# EAGLE design Adafruit LoRa Radio Bonnet with OLED (EAGLE 9.2.0)
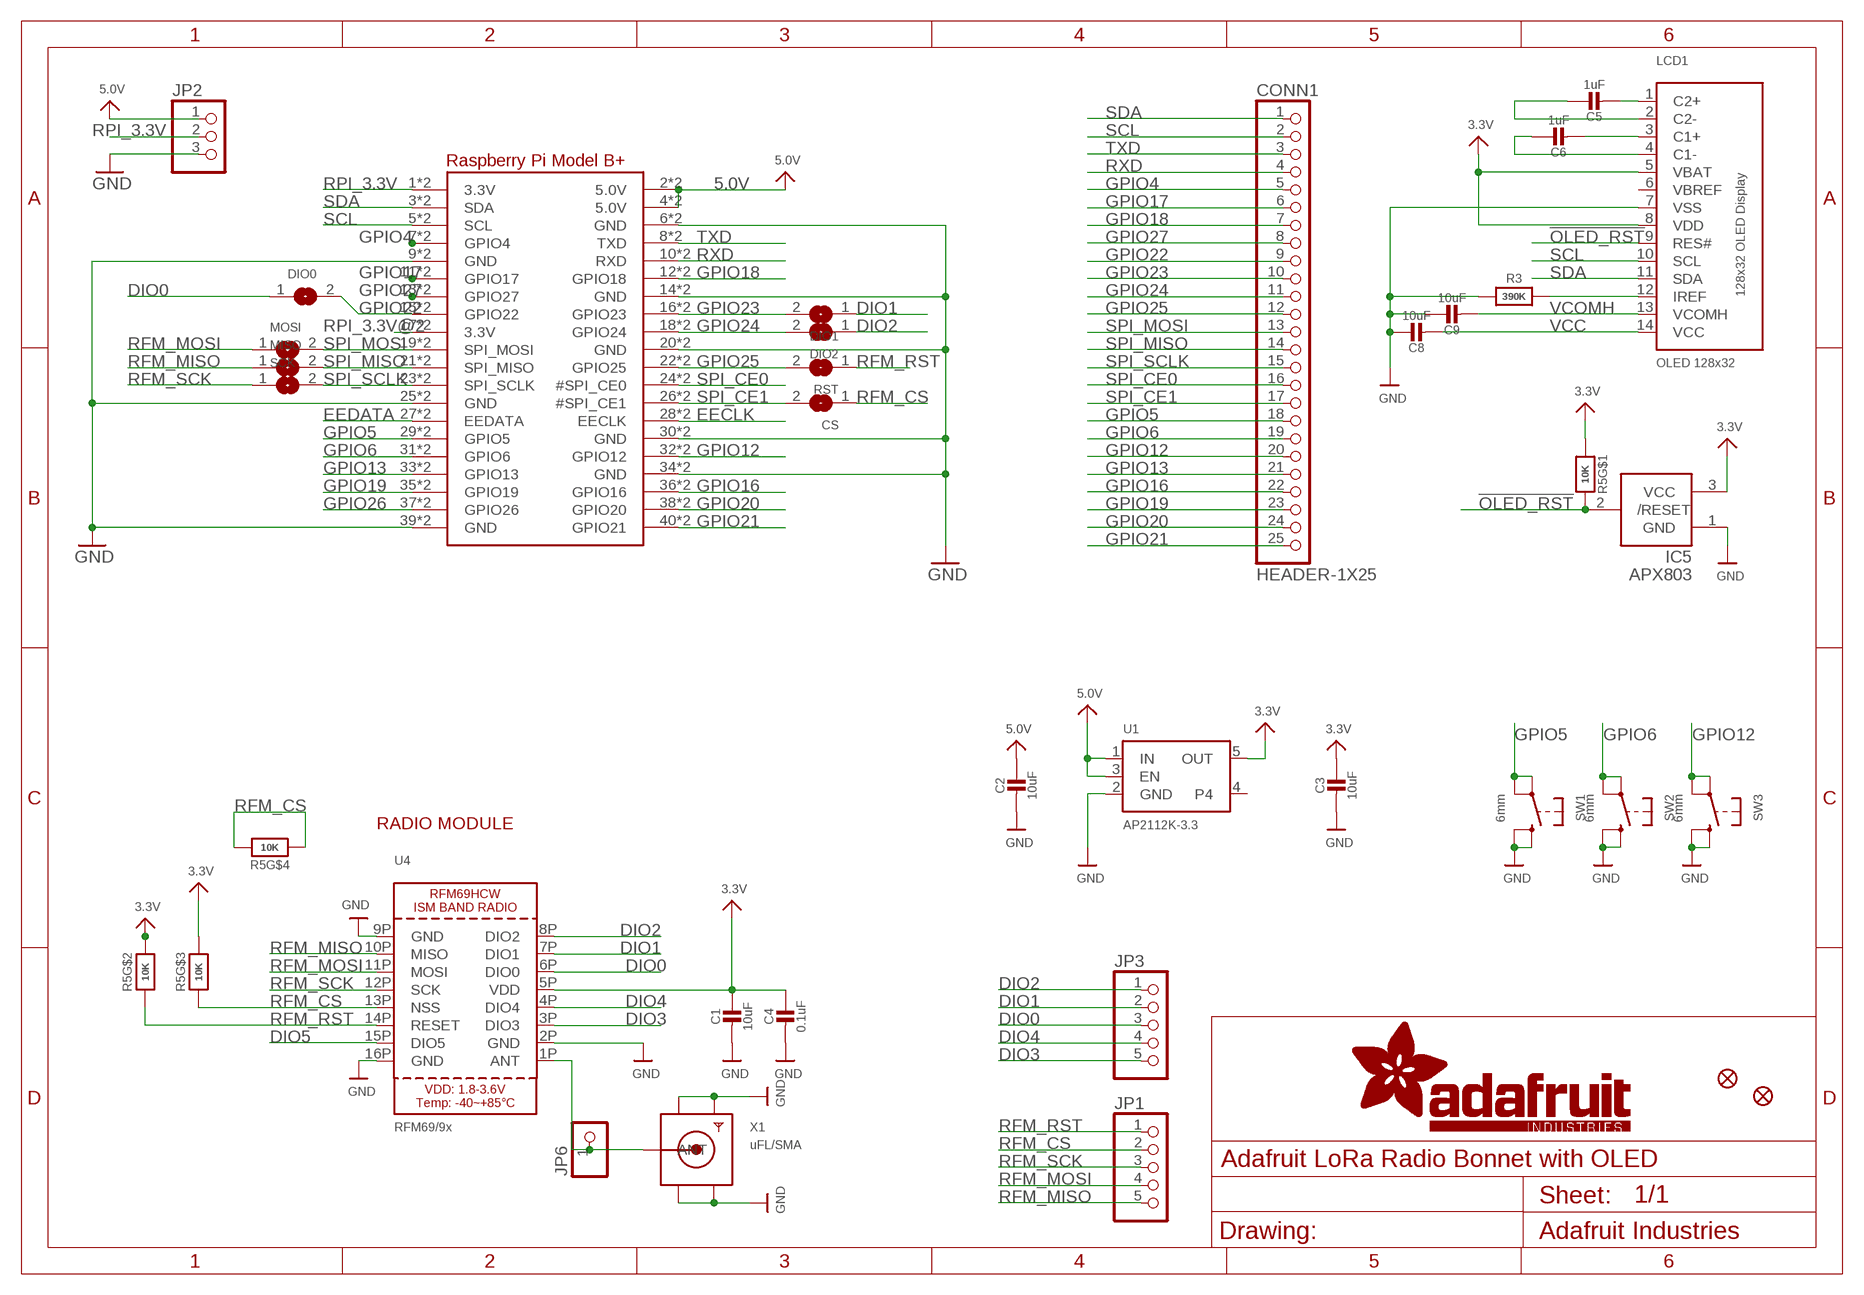
[diagram p0: schematic, sheet 1]

## Parts
C1  10uF  CAP_CERAMIC0805-NOOUTLINE  [0805-NO]
C2  10uF  CAP_CERAMIC0805-NOOUTLINE  [0805-NO]
C3  10uF  CAP_CERAMIC0805-NOOUTLINE  [0805-NO]
C4  0.1uF  CAP_CERAMIC0603_NO  [0603-NO]
C5  1uF  CAP_CERAMIC0603_NO  [0603-NO]
C6  1uF  CAP_CERAMIC0603_NO  [0603-NO]
C8  10uF  CAP_CERAMIC0805-NOOUTLINE  [0805-NO]
C9  10uF  CAP_CERAMIC0805-NOOUTLINE  [0805-NO]
CONN1  HEADER-1X25  [1X25_ROUND_70MIL]
CS  SOLDERJUMPERCLOSED  [SOLDERJUMPER_CLOSEDWIRE]
DIO0  SOLDERJUMPERCLOSED  [SOLDERJUMPER_CLOSEDWIRE]
DIO1  SOLDERJUMPERCLOSED  [SOLDERJUMPER_CLOSEDWIRE]
DIO2  SOLDERJUMPERCLOSED  [SOLDERJUMPER_CLOSEDWIRE]
FID1  FIDUCIAL_1MM  [FIDUCIAL_1MM]
FID2  FIDUCIAL_1MM  [FIDUCIAL_1MM]
IC5  APX803  AXP083-SAG  [SOT23]
JP1  HEADER-1X570MIL  [1X05_ROUND_70]
JP2  HEADER-1X3ROUND  [1X03_ROUND]
JP3  HEADER-1X570MIL  [1X05_ROUND_70]
JP6  HEADER-1X1ROUND  [1X01_ROUND]
LCD1  OLED 128x32  DISP_OLED_UG-2832HSWEG02  [UG-2832HSWEG02_WRAPUNDER]
MISO  SOLDERJUMPERCLOSED  [SOLDERJUMPER_CLOSEDWIRE]
MOSI  SOLDERJUMPERCLOSED  [SOLDERJUMPER_CLOSEDWIRE]
R3  390K  RESISTOR_0603_NOOUT  [0603-NO]
R5  10K  RESISTOR_4PACK  [RESPACK_4X0603]
RPI1  RASPBERRYPI_BPLUS_BONNET_THMSMT  [PI_BONNET_THMSMT]
RST  SOLDERJUMPERCLOSED  [SOLDERJUMPER_CLOSEDWIRE]
SCK  SOLDERJUMPERCLOSED  [SOLDERJUMPER_CLOSEDWIRE]
SW1  6mm  SWITCH_TACT_SMT_EVQQ2_SMALL  [EVQ-Q2_SMALLER]
SW2  6mm  SWITCH_TACT_SMT_EVQQ2_SMALL  [EVQ-Q2_SMALLER]
SW3  6mm  SWITCH_TACT_SMT_EVQQ2_SMALL  [EVQ-Q2_SMALLER]
U1  AP2112K-3.3  VREG_SOT23-5  [SOT23-5]
U4  RFM69/9x  RFM69HCW_SMT  [RFMHCW_SMT]
X1  uFL/SMA  SMACONNECTOR_EDGE_UFL  [SMA_EDGELAUNCH_UFL]

## Nets
3.3V: C1.1 C3.1 C4.1 IC5.3(VCC) LCD1.5(VBAT) LCD1.8(VDD) R5.1 R5.6 R5.7 U1.5(OUT) U4.5P(VDD)
5.0V: C2.1 JP2.1 RPI1.2(5.0V) RPI1.4(5.0V) RPI1.S2(5.0V) RPI1.S4(5.0V) U1.1(IN) U1.3(EN)
!OLED_RST: IC5.2(/RESET) LCD1.9(RES#) R5.8
ANT: JP6.1 U4.1P(ANT) X1.P(ANT)
DIO0: DIO0.1 JP3.3 U4.6P(DIO0)
DIO1: DIO1.1 JP3.2 U4.7P(DIO1)
DIO2: DIO2.1 JP3.1 U4.8P(DIO2)
DIO3: JP3.5 U4.3P(DIO3)
DIO4: JP3.4 U4.4P(DIO4)
DIO5: U4.15P(DIO5)
EECLK: RPI1.28(EECLK) RPI1.S28(EECLK)
EEDATA: RPI1.27(EEDATA) RPI1.S27(EEDATA)
GND: C1.2 C2.2 C3.2 C4.2 C8.1 C9.1 IC5.1(GND) JP2.3 LCD1.7(VSS) R3.1 RPI1.6(GND) RPI1.9(GND) RPI1.14(GND) RPI1.20(GND) RPI1.25(GND) RPI1.30(GND) RPI1.34(GND) RPI1.39(GND) RPI1.S6(GND) RPI1.S9(GND) RPI1.S14(GND) RPI1.S20(GND) RPI1.S25(GND) RPI1.S30(GND) RPI1.S34(GND) RPI1.S39(GND) SW1.B'(S1) SW1.B(S) SW2.B'(S1) SW2.B(S) SW3.B'(S1) SW3.B(S) U1.2(GND) U4.2P(GND) U4.9P(GND) U4.16P(GND) X1.GND@1(GND1) X1.GND@2(GND2) X1.GND@3(GND3) X1.GND@4(GND4)
GPIO4: CONN1.5 RPI1.7(GPIO4) RPI1.S7(GPIO4)
GPIO5: CONN1.18 RPI1.29(GPIO5) RPI1.S29(GPIO5) SW1.A'(P1) SW1.A(P)
GPIO6: CONN1.19 RPI1.31(GPIO6) RPI1.S31(GPIO6) SW2.A'(P1) SW2.A(P)
GPIO12: CONN1.20 RPI1.32(GPIO12) RPI1.S32(GPIO12) SW3.A'(P1) SW3.A(P)
GPIO13: CONN1.21 RPI1.33(GPIO13) RPI1.S33(GPIO13)
GPIO16: CONN1.22 RPI1.36(GPIO16) RPI1.S36(GPIO16)
GPIO17: CONN1.6 RPI1.11(GPIO17) RPI1.S11(GPIO17)
GPIO18: CONN1.7 RPI1.12(GPIO18) RPI1.S12(GPIO18)
GPIO19: CONN1.23 RPI1.35(GPIO19) RPI1.S35(GPIO19)
GPIO20: CONN1.24 RPI1.38(GPIO20) RPI1.S38(GPIO20)
GPIO21: CONN1.25 RPI1.40(GPIO21) RPI1.S40(GPIO21)
GPIO22: CONN1.9 DIO0.2 RPI1.15(GPIO22) RPI1.S15(GPIO22)
GPIO23: CONN1.10 DIO1.2 RPI1.16(GPIO23) RPI1.S16(GPIO23)
GPIO24: CONN1.11 DIO2.2 RPI1.18(GPIO24) RPI1.S18(GPIO24)
GPIO25: CONN1.12 RPI1.22(GPIO25) RPI1.S22(GPIO25) RST.2
GPIO26: RPI1.37(GPIO26) RPI1.S37(GPIO26)
GPIO27: CONN1.8 RPI1.13(GPIO27) RPI1.S13(GPIO27)
N$1: C5.2 LCD1.1(C2+)
N$2: C5.1 LCD1.2(C2-)
N$3: C6.2 LCD1.3(C1+)
N$4: C6.1 LCD1.4(C1-)
N$7: LCD1.12(IREF) R3.2
RFM_CS: CS.1 JP1.2 R5.3 R5.4 R5.5 U4.13P(NSS)
RFM_MISO: JP1.5 MISO.1 U4.10P(MISO)
RFM_MOSI: JP1.4 MOSI.1 U4.11P(MOSI)
RFM_RST: JP1.1 R5.2 RST.1 U4.14P(RESET)
RFM_SCK: JP1.3 SCK.1 U4.12P(SCK)
RPI_3.3V: JP2.2 RPI1.1(3.3V) RPI1.S1(3.3V)
RPI_3.3V@2: RPI1.17(3.3V) RPI1.S17(3.3V)
RXD: CONN1.4 RPI1.10(RXD) RPI1.S10(RXD)
SCL: CONN1.2 LCD1.10(SCL) RPI1.5(SCL) RPI1.S5(SCL)
SDA: CONN1.1 LCD1.11(SDA) RPI1.3(SDA) RPI1.S3(SDA)
SPI_CE0: CONN1.16 RPI1.24(#SPI_CE0) RPI1.S24(#SPI_CE0)
SPI_CE1: CONN1.17 CS.2 RPI1.26(#SPI_CE1) RPI1.S26(#SPI_CE1)
SPI_MISO: CONN1.14 MISO.2 RPI1.21(SPI_MISO) RPI1.S21(SPI_MISO)
SPI_MOSI: CONN1.13 MOSI.2 RPI1.19(SPI_MOSI) RPI1.S19(SPI_MOSI)
SPI_SCLK: CONN1.15 RPI1.23(SPI_SCLK) RPI1.S23(SPI_SCLK) SCK.2
TXD: CONN1.3 RPI1.8(TXD) RPI1.S8(TXD)
VCC: C8.2 LCD1.14(VCC)
VCOMH: C9.2 LCD1.13(VCOMH)
Unconnected: U1.4

## Notes on the sheet
- RADIO MODULE

## Power pins joined to a net without a drawn wire
VBREF: LCD1.6(VBREF)

## Library data of the parts
C1-C6 C8 C9 = microbuilder:CAP_CERAMIC: Ceramic Capacitors For new designs, use the packages preceded by an '_' character since they are more reliable: The following footprints should be used on most boards: _0402 - Standard footprint for regular board layouts _0603 - Standard footprint for regular board layouts _0805 - Standard footprint for regular board layouts _1206 - Standard footprint for regular board layouts For extremely tight-pitch boards where space is at a premium, the following 'micro-pitch' footprints can be used (smaller pads, no silkscreen outline, etc.): _0402MP - Micro-pitch footprint for very dense/compact boards _0603MP - Micro-pitch footprint for very dense/compact boards _0805MP - Micro-pitch footprint for very dense/compact boards _1206MP - Micro-pitch footprint for very dense/compact boards
CONN1 = microbuilder:HEADER-1X25
CS DIO0 DIO1 DIO2 MISO MOSI RST SCK = microbuilder:SOLDERJUMPER: SMD Solder JUMPER Solder the two pads together to create a connection, or remove the solder to break it. REFLOW - Use this footprint for solder paste and reflow ovens. WAVE - Use this footprint for hand-soldering (larger pads). CLOSED - Has a trace between the two pads to ensure it is closed by default. The trace needs to be cut to disable the jumper, and can be closed again by creating a solder bridge between the two pads.
FID1 FID2 = microbuilder:FIDUCIAL: Fiducial Alignment Points Various fiducial points for machine vision alignment.; BOM: EXCLUDE
IC5 = adafruit:AXP083
JP1 JP3 = microbuilder:HEADER-1X5: PIN HEADER
JP2 = microbuilder:HEADER-1X3: PIN HEADER
JP6 = microbuilder:HEADER-1X1: PIN HEADER
LCD1 = microbuilder:DISP_OLED_UG-2832HSWEG02: 128x32 I2C 0.91" Monochrome OLED Display
R3 = microbuilder:RESISTOR: Resistors For new designs, use the packages preceded by an '_' character since they are more reliable: The following footprints should be used on most boards: _0402 - Standard footprint for regular board layouts _0603 - Standard footprint for regular board layouts _0805 - Standard footprint for regular board layouts _1206 - Standard footprint for regular board layouts For extremely tight-pitch boards where space is at a premium, the following 'micro-pitch' footprints can be used (smaller pads, no silkscreen outline, etc.): _0402MP - Micro-pitch footprint for very dense/compact boards _0603MP - Micro-pitch footprint for very dense/compact boards _0805MP - Micro-pitch footprint for very dense/compact boards _1206MP - Micro-pitch footprint for very dense/compact boards
R5 = microbuilder:RESISTOR_4PACK: Resistor Packs (4 resistors) 4 x 0603 10K 1/16W - Digikey: YC164J-10KCT-ND
RPI1 = microbuilder:RASPBERRYPI_BPLUS
SW1-SW3 = microbuilder:SWITCH_TACT_SMT: SMT Tact Switches 6x6mm - Digikey: P12940SCT-ND KMR2 (4.6x2.8mm) - Digikey: 401-1426-1-ND EVQ-PQHB55 - Light Touch, 160GF (4.5x4.5mm) - Digikey: P8090SCT-ND KMT0 - KMT021 NGJ LHS (etc.) IP68/Waterproof - Digikey: CKN10289CT-ND
U1 = microbuilder:VREG_SOT23-5: SOT23-5 Fixed Voltage Regulators Part Current Out V Out V In V Dropout θJA (°C/W) TJ (°C) Digikey Part No. ADP121 150mA 3.3V 3.4-5.5V 0.09V @ 150mA -- -- ADP121-AUJZ33R7CT-ND ADP121 150mA 3.0V 3.1-5.5V 0.09V @ 150mA -- -- ADP121-AUJZ30R7CT-ND ADP122 300mA 3.3V 3.4-5.5V 0.085V @ 300mA -- -- ADP122AUJZ-3.3-R7CT-ND ADP1712 300mA 3.3V 3.5-5.5V 0.17V @ 300mA -- -- ADP1712AUJZ-3.3-R7TR-ND AP7311 (Low Cost) 150mA 3.3V 3.5-6V 0.15V @ 150mA -- -- AP7311-33WG-7DICT-ND LD39015M18R 150mA 1.8V 1.9V-5.5V 0.08V @ 100mA -- -- 497-6977-1-ND LP2985A-33DBVR 150mA 3.3V 3.3-16V 0.28V @ 150mA 206 150 296-18479-1-ND MCP1824T-3302E/OT 300mA 3.3V 3.5V-6V 0.2V @ 300mA -- -- MCP1824T-3302E/OTCT-ND MIC5205-2.5YM5 TR 150mA 2.5V 2.7-16V 0.165V @ 150mA -- -- 576-1257-2-ND MIC5205-3.0YM5 TR 150mA 3.0V 3.2V-16V 0.165V @ 150mA -- -- 576-1258-2-ND MIC5205-3.3YM5 TR 150mA 3.3V 3.5V-16V 0.165V @ 150mA -- -- 576-1259-2-ND TPS780330220 150mA 3.3V+2.2V 3.6-5.5V 250mV Max -- -- 296-23332-1-ND TDA3663/N1,135 100mA 3.3V 3.5-45V 0.18V @ 50mA -- -- 568-5343-1-ND Max operating temp can be calculated using θJA, TJ (max junction temperature), and power in watts. Set the "Maximum Ambient Temperature" until it reaches TJ ("Max Junction Temperature"), which is the absolute limit for safe use of the regulator: Heat Sink Temperature Calculator <http://www.daycounter.com/Calculators/Heat-Sink-Temperature-Calculator.phtml> For example, With 12V source into a 3.3V LP2985 and a 30mA load, we are dissipating (12V-3.3V) * 0.03A = 0.261W. With a θJA of 206 °C/W, a TJ of 150°C, and 261mW we can safely use the chip without a heat sink up to 75°C (=147.1°C Junction Temperature).
U4 = microbuilder:RFM69HCW: RFM69HCW - ISM Band RF Transceiver
X1 = microbuilder:SMACONNECTOR: SMA Connector 90° DIP SMA Connector, 50 Ohm (4UConnector: 07259)

## Board
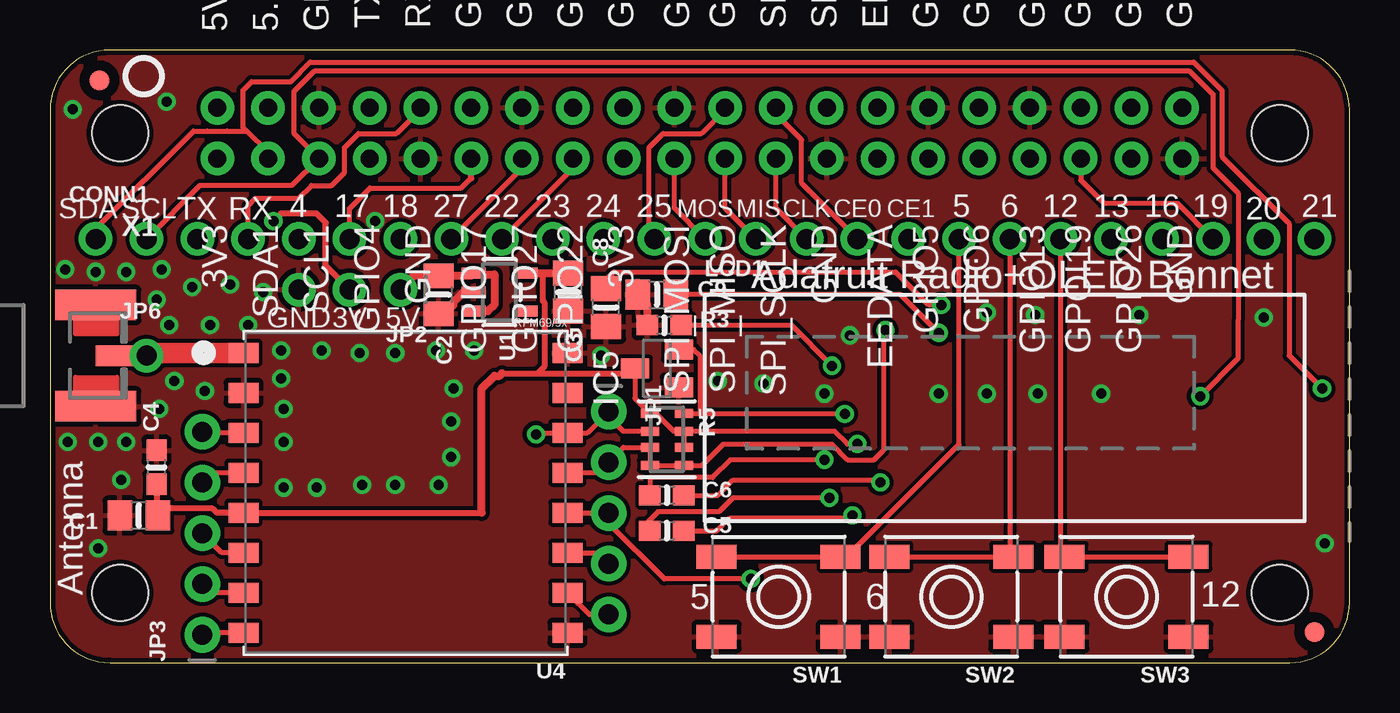
[diagram p1: board, top side]
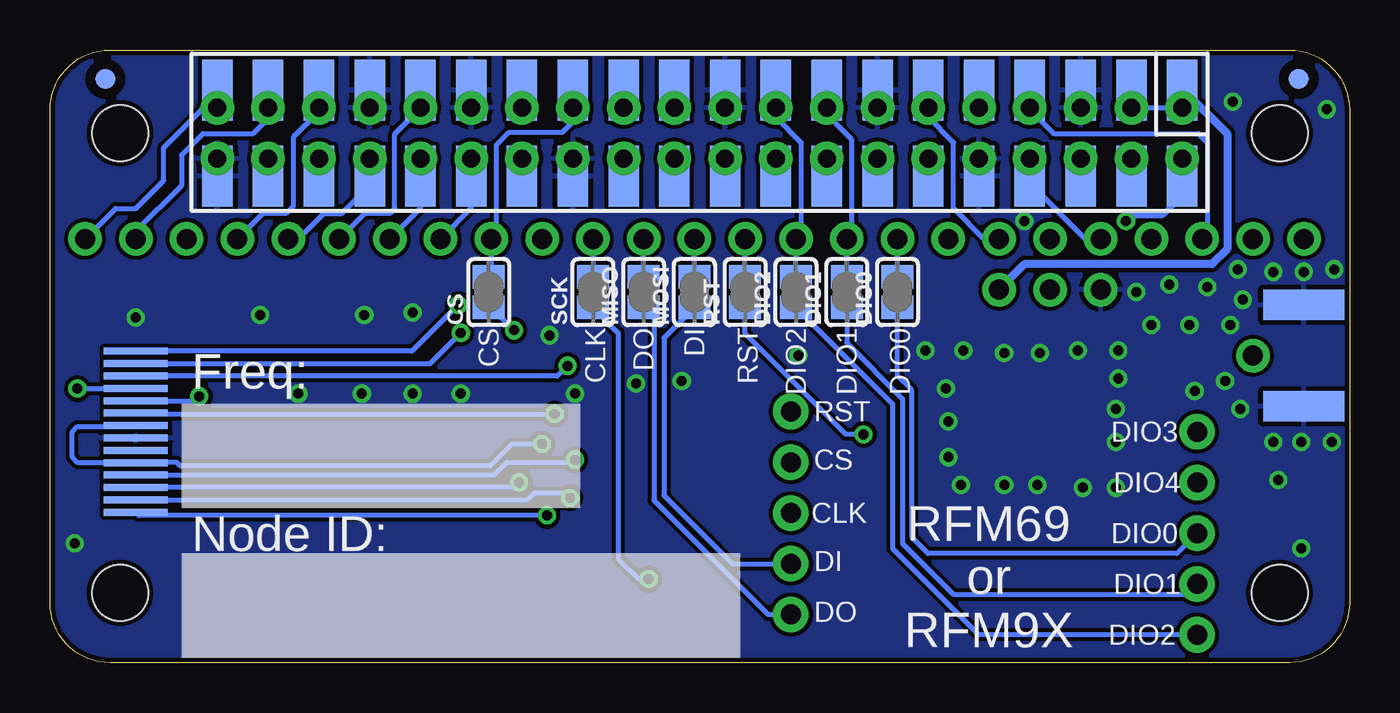
[diagram p2: board, bottom side, seen from below]

Size 65 x 30.66 mm. Coordinates in mm from the lower left corner, seen from the top.
Copper layers (1*16): Top 0.035mm / dielectric 1.5mm / Bottom 0.035mm
Design rules "adafruit *": minimum track width 8mil, minimum drill 15.5mil, track to track 8mil, track to pad 8mil, pad to pad 8mil, via to via 8mil, smd to smd 8mil, copper to edge 10mil, drill to drill 8mil, minimum pad ring 10mil, minimum via ring 8mil, stop-mask expansion 2mil, vias tented up to drill 20mil, thermal gap 10mil

### Footprints (pad centres in the part's own frame; a part is rotated, then mirrored left to right if it is on the bottom)
0805-NO = smd 1.24 x 1.5: 1 -0.95,0; 2 0.95,0
0603-NO = smd 1.075 x 1: 1 -0.85,0; 2 0.85,0
1X25_ROUND_70MIL = drill 1 pad 1.676: 1 -30.48,0; 2 -27.94,0; 3 -25.4,0; 4 -22.86,0; 5 -20.32,0; 6 -17.78,0; 7 -15.24,0; 8 -12.7,0; 9 -10.16,0; 10 -7.62,0; 11 -5.08,0; 12 -2.54,0; 13 0,0; 14 2.54,0; 15 5.08,0; 16 7.62,0; 17 10.16,0; 18 12.7,0; 19 15.24,0; 20 17.78,0; 21 20.32,0; 22 22.86,0; 23 25.4,0; 24 27.94,0; 25 30.48,0
SOLDERJUMPER_CLOSEDWIRE = smd 1.168 x 1.6: 1 -0.762,0; 2 0.762,0 | smd 0.635 x 0.203: WIRE 0,0
FIDUCIAL_1MM = smd 1 x 1: 1 0,0
SOT23 = smd 1 x 1.4: 1 -0.95,-1.1; 2 0.95,-1.1; 3 0,1.1
1X05_ROUND_70 = drill 1 pad 1.778: 1 -5.08,0; 2 -2.54,0; 3 0,0; 4 2.54,0; 5 5.08,0
1X03_ROUND = drill 1 pad 1.676: 1 -2.54,0; 2 0,0; 3 2.54,0
1X01_ROUND = drill 1 pad 1.676: 1 0,0
UG-2832HSWEG02_WRAPUNDER = smd 3.2 x 0.35 bottom: 1 -2.03,-5.3; 2 -2.03,-4.68; 3 -2.03,-4.06; 4 -2.03,-3.44; 5 -2.03,-2.82; 6 -2.03,-2.2; 7 -2.03,-1.58; 8 -2.03,-0.96; 9 -2.03,-0.34; 10 -2.03,0.28; 11 -2.03,0.9; 12 -2.03,1.52; 13 -2.03,2.14; 14 -2.03,2.76
RESPACK_4X0603 = smd 0.45 x 0.9: 1 -1.3,-0.85; 2 -0.4,-0.85; 3 0.4,-0.85; 4 1.3,-0.85; 5 1.3,0.85; 6 0.4,0.85; 7 -0.4,0.85; 8 -1.3,0.85
PI_BONNET_THMSMT = drill 0.9 pad 1.676: 1 8.37,25.23; 2 8.37,27.77; 3 10.91,25.23; 4 10.91,27.77; 5 13.45,25.23; 6 13.45,27.77; 7 15.99,25.23; 8 15.99,27.77; 9 18.53,25.23; 10 18.53,27.77; 11 21.07,25.23; 12 21.07,27.77; 13 23.61,25.23; 14 23.61,27.77; 15 26.15,25.23; 16 26.15,27.77; 17 28.69,25.23; 18 28.69,27.77; 19 31.23,25.23; 20 31.23,27.77; 21 33.77,25.23; 22 33.77,27.77; 23 36.31,25.23; 24 36.31,27.77; 25 38.85,25.23; 26 38.85,27.77; 27 41.39,25.23; 28 41.39,27.77; 29 43.93,25.23; 30 43.93,27.77; 31 46.47,25.23; 32 46.47,27.77; 33 49.01,25.23; 34 49.01,27.77; 35 51.55,25.23; 36 51.55,27.77; 37 54.09,25.23; 38 54.09,27.77; 39 56.63,25.23; 40 56.63,27.77 | smd 1 x 1 bottom: 41 2.54,29.21; 42 62.23,29.21 | smd 1.524 x 3.048 bottom: S1 8.37,24.339; S2 8.37,28.657; S3 10.91,24.339; S4 10.91,28.657; S5 13.45,24.339; S6 13.45,28.657; S7 15.99,24.339; S8 15.99,28.657; S9 18.53,24.339; S10 18.53,28.657; S11 21.07,24.339; S12 21.07,28.657; S13 23.61,24.339; S14 23.61,28.657; S15 26.15,24.339; S16 26.15,28.657; S17 28.69,24.339; S18 28.69,28.657; S19 31.23,24.339; S20 31.23,28.657; S21 33.77,24.339; S22 33.77,28.657; S23 36.31,24.339; S24 36.31,28.657; S25 38.85,24.339; S26 38.85,28.657; S27 41.39,24.339; S28 41.39,28.657; S29 43.93,24.339; S30 43.93,28.657; S31 46.47,24.339; S32 46.47,28.657; S33 49.01,24.339; S34 49.01,28.657; S35 51.55,24.339; S36 51.55,28.657; S37 54.09,24.339; S38 54.09,28.657; S39 56.63,24.339; S40 56.63,28.657 | hole 2.8: 3.5,26.5; 61.5,26.5; 61.5,3.5; 3.5,3.5
EVQ-Q2_SMALLER = smd 2 x 1.2: A -3.1,-2; A' 3.1,-2; B -3.1,2; B' 3.1,2
SOT23-5 = smd 0.55 x 1.2: 1 -0.95,-1.3; 2 0,-1.3; 3 0.95,-1.3; 4 0.95,1.3; 5 -0.95,1.3
RFMHCW_SMT = smd 1.5 x 1: 1P 8.1,-7; 2P 8.1,-5; 3P 8.1,-3; 4P 8.1,-1; 5P 8.1,1; 6P 8.1,3; 7P 8.1,5; 8P 8.1,7; 9P -8.1,7; 10P -8.1,5; 11P -8.1,3; 12P -8.1,1; 13P -8.1,-1; 14P -8.1,-3; 15P -8.1,-5; 16P -8.1,-7
SMA_EDGELAUNCH_UFL = smd 4.064 x 1.524: GND@1 2.032,-2.54; GND@2 2.032,2.54 | smd 4.064 x 1.524 bottom: GND@3 2.032,2.54; GND@4 2.032,-2.54 | smd 2.032 x 1.016: P 3.048,0

### Placement (x,y rotation side)
C1  4.45,7.37 180 top
C2  19.43,18.41 270 top
C3  25.91,18.54 270 top
C4  5.33,9.78 90 top
C5  30.86,6.6 0 top
C6  30.86,8.38 0 top
C8  27.81,17.78 90 top
C9  30.35,18.41 0 top
CONN1  32.77,21.21 0 top
CS  43.05,18.54 90 bottom
DIO0  22.61,18.54 90 bottom
DIO1  25.15,18.54 90 bottom
DIO2  27.69,18.54 90 bottom
FID1  2.48,29.15 0 top
FID2  63.25,1.52 0 top
IC5  30.35,14.73 90 top
JP1  27.94,7.49 270 top
JP2  14.99,18.67 180 top
JP3  7.62,6.48 90 top
JP6  4.83,15.37 0 top
LCD1  62.74,12.83 0 top
MISO  35.31,18.54 90 bottom
MOSI  32.77,18.54 90 bottom
R3  30.73,16.89 0 top
R5  30.86,11.18 270 top
RPI1  0,0 0 top
RST  30.23,18.54 90 bottom
SCK  37.85,18.54 90 bottom
SW1  36.45,3.3 180 top
SW2  45.09,3.3 180 top
SW3  53.85,3.3 180 top
U1  22.48,18.54 270 top
U4  17.78,8.51 180 top
U$22  [PCBFEAT-REV-040]  4.7,29.34 0 top
X1  0.25,15.37 0 top

### Tracks (layer width: path | path; a pad name or v marks a point on that pad's centre or on a via)
3.3V  (via drill 0.5)
  Top 0.254: R5.7 R5.6 | v40.39,10.94 39.88,10.94 39.24,11.58 R5.7 | IC5.3 29.25,13.23 R5.1 30.32,12.48 31.22,11.58 R5.7
  Top 0.305: C4.1 5.33,7.43 C1.1 5.75,7.72 8.14,7.72 8.35,7.51 U4.5P 21.59,7.51 | 22.61,14.48 24.38,14.48 | 24.38,14.48 29,14.48 IC5.3 | 24.64,19.49 24.64,18.11 24.73,18.01 24.73,14.83 24.38,14.48
  Top 0.406: U1.5 24.64,19.49 C3.1 | 21.59,7.51 21.59,13.72 22.23,14.35 22.48,14.35 22.61,14.48
  Bottom 0.254: v40.39,10.94 41.9,10.94 43,9.84 58.48,9.84 58.67,10.03 60.68,10.03 LCD1.5 63.6,10.01 63.88,10.29 63.88,11.56 63.63,11.81 60.76,11.81 LCD1.8
5.0V
  Top 0.406: U1.3 21.91,17.59 22.23,17.91 22.23,19.43 21.24,19.43 U1.1 21.05,19.36 C2.1 18.22,19.36 JP2.1
  Bottom 0.254: RPI1.4 10.67,27.77 RPI1.2 | RPI1.S2 RPI1.2 | RPI1.2
  Bottom 0.406: RPI1.S4 10.67,28.42 10.67,27.77 | JP2.1 16.26,19.94 6.88,19.94 6.12,20.69 6.12,26.48 8.3,28.66 RPI1.S2
!OLED_RST  (via drill 0.5)
  Top 0.254: R5.8 32.51,12.48 | 32.51,12.48 39.72,12.48 v39.75,12.45 | IC5.2 32.2,15.68 32.51,15.37 32.51,12.48
  Bottom 0.254: v39.75,12.45 60.67,12.45 LCD1.9
ANT
  Top 1.016: U4.1P 4.97,15.51 JP6.1 X1.P
DIO0
  Top 0.254: U4.6P 8.59,5.51 JP3.3
  Bottom 0.254: JP3.3 8.64,5.46 21.08,5.46 21.89,6.27 21.89,13.64 22.61,14.35 DIO0.1
DIO1
  Top 0.254: U4.7P 8.05,3.51 JP3.2
  Bottom 0.254: 22.35,13.21 22.35,5.97 19.81,3.43 8.13,3.43 JP3.2 | DIO1.1 25.15,16 22.35,13.21 | 22.35,13.21
DIO2
  Top 0.254: U4.8P 7.73,1.51 JP3.1
  Bottom 0.254: JP3.1 18.54,1.4 22.86,5.71 22.86,12.95 DIO2.1
DIO3
  Top 0.254: U4.3P 7.67,11.51 JP3.5
DIO4
  Top 0.254: U4.4P 8.11,9.51 JP3.4
EECLK
  Bottom 0.254: RPI1.S28 RPI1.28 | RPI1.28
EEDATA
  Bottom 0.254: RPI1.S27 RPI1.27 | RPI1.27
GND  (via drill 0.5)
  Top 0.406: R3.1 29.88,17.93 C9.1 | U1.2 20.68,18.54 20.17,18.04 20.17,17.89 19.75,17.46 C2.2
  Bottom 0.254: RPI1.6 | RPI1.S14 RPI1.14 | RPI1.14 | RPI1.S9 RPI1.9 | RPI1.S6 RPI1.6 | RPI1.S34 | RPI1.S34 RPI1.34 | RPI1.S30 | RPI1.S30 RPI1.30 | RPI1.S39 RPI1.39
  other vias: 2.41,11.05 0.89,11.05 3.81,11.05 3.56,9.14 5.46,12.7 11.56,15.62 6.22,14.1 5.97,16.89 8,16.89 9.91,16.89 5.33,18.16 3.81,19.56 2.29,19.56 0.76,19.68 5.84,28.07 1.14,27.69 16.26,22.1 7.75,13.59 11.56,14.22 11.68,12.7 11.68,11.05 11.68,8.76 13.34,8.76 15.62,8.89 17.27,8.89 20.07,10.29 20.07,12.07 20.19,13.72 17.27,15.49 15.49,15.49 13.59,15.62 19.43,8.89 19.3,15.62 21.21,15.62 27.56,15.37 5.59,19.68 7.11,18.8 9.02,18.92 10.67,18.54 33.4,14.1 35.69,13.97 63.75,5.97 44.45,13.46 52.58,13.46 49.4,13.46 46.86,13.46 46.86,17.53 49.28,17.4 54.48,17.4 60.71,17.27 40.01,16.38 38.73,13.46 2.41,5.71
  pour Top: 65.02,30.61 65.02,0.13 0,0.13 0,30.61
  pour Bottom: 65.02,30.61 65.02,0.13 0,0.13 0,30.61
GPIO4
  Bottom 0.254: RPI1.S7 RPI1.7 15.99,23.99 13.21,21.21 CONN1.5
GPIO5
  Top 0.254: SW1.A' SW1.A 39.85,5.3 45.47,10.92 CONN1.18
  Bottom 0.254: RPI1.29 RPI1.S29 | RPI1.S29 43.93,22.74 CONN1.18 | RPI1.S29
GPIO6
  Top 0.254: SW2.A' SW2.A 48.01,5.48 CONN1.19
  Bottom 0.254: RPI1.31 46.47,25.02 | 46.47,25.02 46.47,22.74 CONN1.19 | RPI1.S31 46.47,25.02
GPIO12
  Top 0.254: CONN1.20 50.55,5.5 SW3.A' SW3.A
  Bottom 0.254: CONN1.20 49.27,22.48 48,22.48 47.75,22.73 47.75,26.45 46.47,27.73 RPI1.32 RPI1.S32 | RPI1.S32
GPIO13
  Bottom 0.254: CONN1.21 52.83,21.46 52.32,21.46 51.31,22.48 50.42,22.48 49.01,23.89 RPI1.S33 RPI1.33 | RPI1.33
GPIO16
  Bottom 0.254: 51.55,27.42 RPI1.36 | CONN1.22 54.36,22.48 53.2,22.48 52.83,22.84 52.83,26.29 51.55,27.57 RPI1.S36 51.55,27.42 | 51.55,27.42
GPIO17
  Top 0.254: CONN1.6 14.99,22.73 16,23.75 20.57,23.75 21.07,24.24
  Top 0.305: 21.07,24.24 RPI1.11
  Bottom 0.254: RPI1.S11 RPI1.11
GPIO18
  Bottom 0.254: RPI1.12 21.07,27.29 19.81,26.04 19.81,22.74 18.28,21.21 CONN1.7 | RPI1.S12 RPI1.12 | RPI1.12
GPIO19
  Top 0.254: RPI1.35 51.55,24.14 52.7,22.99 56.39,22.99 CONN1.23
  Bottom 0.254: RPI1.S35 RPI1.35
GPIO20
  Bottom 0.254: CONN1.24 60.71,21.59 58.42,23.88 58.42,25.4 57.34,26.48 54.84,26.48 54.09,27.23 RPI1.38 RPI1.S38 | RPI1.S38
GPIO21
  Bottom 0.254: CONN1.25 61.72,22.73 60.71,22.73 59.31,24.13 59.31,25.78 57.32,27.77 RPI1.40 | RPI1.S40 RPI1.40 | RPI1.40
GPIO22
  Top 0.254: CONN1.9 26.15,24.75 RPI1.15
  Bottom 0.254: RPI1.15 | RPI1.S15 RPI1.15 | DIO0.2 CONN1.9
GPIO23
  Bottom 0.254: 26.15,27.56 26.15,27.42 24.89,26.16 24.89,21.46 CONN1.10 DIO1.2 | 26.15,27.56 RPI1.16 | RPI1.S16 26.15,27.56 | 26.15,27.56
GPIO24
  Bottom 0.254: RPI1.18 28.69,27.29 27.43,26.04 27.43,21.46 CONN1.11 DIO2.2 | RPI1.S18 RPI1.18 | RPI1.18
GPIO25
  Top 0.254: CONN1.12 29.97,21.46 29.97,25.78 30.67,26.48 32.58,26.48 33.77,27.67 RPI1.22
  Bottom 0.254: RPI1.S22 RPI1.22 | RPI1.22 | RST.2 CONN1.12
GPIO26
  Bottom 0.254: RPI1.S37 RPI1.37
GPIO27
  Top 0.254: CONN1.8 23.61,24.75 RPI1.13
  Bottom 0.254: RPI1.S13 RPI1.13
N$1  (via drill 0.5)
  Top 0.254: v40.13,7.37 40.01,7.24 34,7.24 33.36,6.6 C5.2
  Bottom 0.254: v40.13,7.37 60.55,7.37 LCD1.1
N$2  (via drill 0.5)
  Top 0.254: v38.99,8.26 34.16,8.26 33.46,7.55 30.41,7.55 29.72,6.86 29.97,6.6 C5.1
  Bottom 0.254: LCD1.2 41.13,8.15 40.77,8.51 39.24,8.51 v38.99,8.26
N$3  (via drill 0.5)
  Top 0.254: C6.2 33.4,8.38 34.16,9.14 41.4,9.14 v41.53,9.02
  Bottom 0.254: v41.53,9.02 41.78,8.77 LCD1.3
N$4  (via drill 0.5)
  Top 0.254: v38.73,10.16 34.04,10.16 33.15,9.27 30.01,9.27 C6.1
  Bottom 0.254: LCD1.4 42.81,9.39 42.16,10.03 39.12,10.03 38.99,10.16 v38.73,10.16
N$7  (via drill 0.5)
  Top 0.254: R3.2 37.08,16.89 v39.12,14.86
  Bottom 0.254: LCD1.12 39.63,14.35 v39.12,14.86
RFM_CS  (via drill 0.5)
  Top 0.254: U4.13P 27.42,9.51 JP1.2 28.68,10.78 R5.3 R5.4 R5.5 32.61,9.88 33.68,10.94 39.1,10.94 39.89,10.16 41.22,10.16 41.68,10.62 41.68,16.53 v41.78,16.64
  Bottom 0.254: CS.1 42.93,17.78 v41.78,16.64
RFM_MISO
  Top 0.254: U4.10P 26.98,2.41 JP1.5
  Bottom 0.254: MISO.1 34.8,17.27 34.8,8.13 29.08,2.41 JP1.5
RFM_MOSI
  Top 0.254: U4.11P 27.38,5.51 JP1.4
  Bottom 0.254: MOSI.1 34.29,16.26 34.29,8.38 30.86,4.95 JP1.4
RFM_RST  (via drill 0.5)
  Top 0.254: R5.2 28.68,11.58 27.94,12.32 JP1.1 26.88,11.51 U4.14P 24.3,11.51 v24.3,11.43
  Bottom 0.254: v24.3,11.43 25.19,11.43 30.23,16.46 RST.1
RFM_SCK  (via drill 0.5)
  Top 0.254: U4.12P 27.92,7.51 JP1.3 27.94,6.98 30.73,4.19 v35.05,4.19
  Bottom 0.254: SCK.1 36.58,16.51 36.58,5.21 35.56,4.19 v35.05,4.19
RPI_3.3V  (via drill 0.5)
  Top 0.305: JP2.2 13.79,19.86 13.79,22.02 13.34,22.48 11.56,22.48 v11.18,22.1
  Bottom 0.254: RPI1.S1 8.37,24.89 RPI1.1
  Bottom 0.305: v11.18,22.1 11.18,22.4 9.35,22.4 8.37,23.38 8.37,24.89
RPI_3.3V@2
  Bottom 0.254: RPI1.17 28.69,25.27 RPI1.S17
RXD
  Top 0.254: RPI1.10 18.53,27.67 17.34,26.48 15.43,26.48 14.73,25.78 14.73,24.51 14.1,23.88 13.08,23.88 12.45,23.24 10.29,23.24 9.91,22.86 CONN1.4
  Bottom 0.254: RPI1.S10 RPI1.10 | RPI1.10
SCL  (via drill 0.5)
  Top 0.254: v57.53,13.34 59.44,15.24 59.44,17.14 59.44,23.49 58.17,24.77 58.17,28.45 57.02,29.59 13.21,29.59 12.19,28.57 12.19,26.49 RPI1.5 12.1,23.88 7.49,23.88 CONN1.2
  Bottom 0.254: RPI1.S5 RPI1.5 | LCD1.10 57.76,13.11 v57.53,13.34
SDA  (via drill 0.5)
  Top 0.254: CONN1.1 2.29,21.72 7.18,26.61 7.88,26.61 7.89,26.6 8.85,26.6 8.86,26.61 9.84,26.61 | v63.63,13.72 61.98,15.37 61.98,21.97 58.62,25.32 58.62,28.64 57.21,30.05 13.02,30.05 12.05,29.08 10.08,29.08 9.65,28.65 9.65,26.8 9.84,26.61 | RPI1.3 10.91,25.54 9.84,26.61
  Bottom 0.254: RPI1.S3 RPI1.3 | v63.63,13.72 63.62,13.73 LCD1.11
SPI_CE0
  Top 0.254: CONN1.16 37.59,24 37.59,26.16 36.31,27.44 RPI1.24
  Bottom 0.254: RPI1.S24 | RPI1.S24 RPI1.24
SPI_CE1
  Bottom 0.254: CS.2 42.93,19.43 CONN1.17 42.67,21.46 42.67,25.91 42.04,26.54 39.37,26.54 38.85,27.06 38.85,27.69 RPI1.26 RPI1.S26 | RPI1.S26
SPI_MISO
  Top 0.254: CONN1.14 33.77,22.74 RPI1.21
  Bottom 0.254: MISO.2 CONN1.14 | RPI1.S21 RPI1.21 | RPI1.21
SPI_MOSI
  Top 0.254: CONN1.13 31.23,22.74 RPI1.19
  Bottom 0.254: MOSI.2 CONN1.13 | RPI1.S19 RPI1.19
SPI_SCLK
  Top 0.254: CONN1.15 36.31,22.74 RPI1.23
  Bottom 0.254: CONN1.15 SCK.2 | RPI1.S23 RPI1.23 | RPI1.23
TXD
  Bottom 0.254: RPI1.8 15.99,27.67 14.8,26.48 7.56,26.48 7.11,26.04 7.11,21.72 7.37,21.46 CONN1.3 | RPI1.S8 RPI1.8 | RPI1.8
VCC  (via drill 0.5)
  Top 0.254: C8.2 27.81,19.18 28.19,19.56 42.29,19.56 43.94,17.91 v44.58,17.91
  Bottom 0.254: v44.58,17.91 46.9,15.59 LCD1.14
VCOMH  (via drill 0.5)
  Top 0.254: v44.45,16.51 42.55,18.41 C9.2
  Bottom 0.254: LCD1.13 45.99,14.97 v44.45,16.51

### Text on the board
tPlace: SDA | SCL | TX | RX | 4 | 17 | 18 | 27 | 22 | 23 | 24 | 25 | MOS | MIS | CLK | CE0 | CE1 | 5 | 6 | 12 | 13 | 16 | 19 | 20 | 21 | Adafruit Radio+OLED Bonnet | GND | 3V | 5V | Antenna | 5 | 6 | 12
bPlace: DIO0 | DIO1 | DIO2 | RST | DI | DO | CLK | CS | Freq: | RST | DIO3 | CS | DIO4 | CLK | DIO0 | Node ID: | RFM69 / or / RFM9X | DI | DIO1 | DO | DIO2